# EAGLE design 1u_panel_breakout (EAGLE 9.3.2)
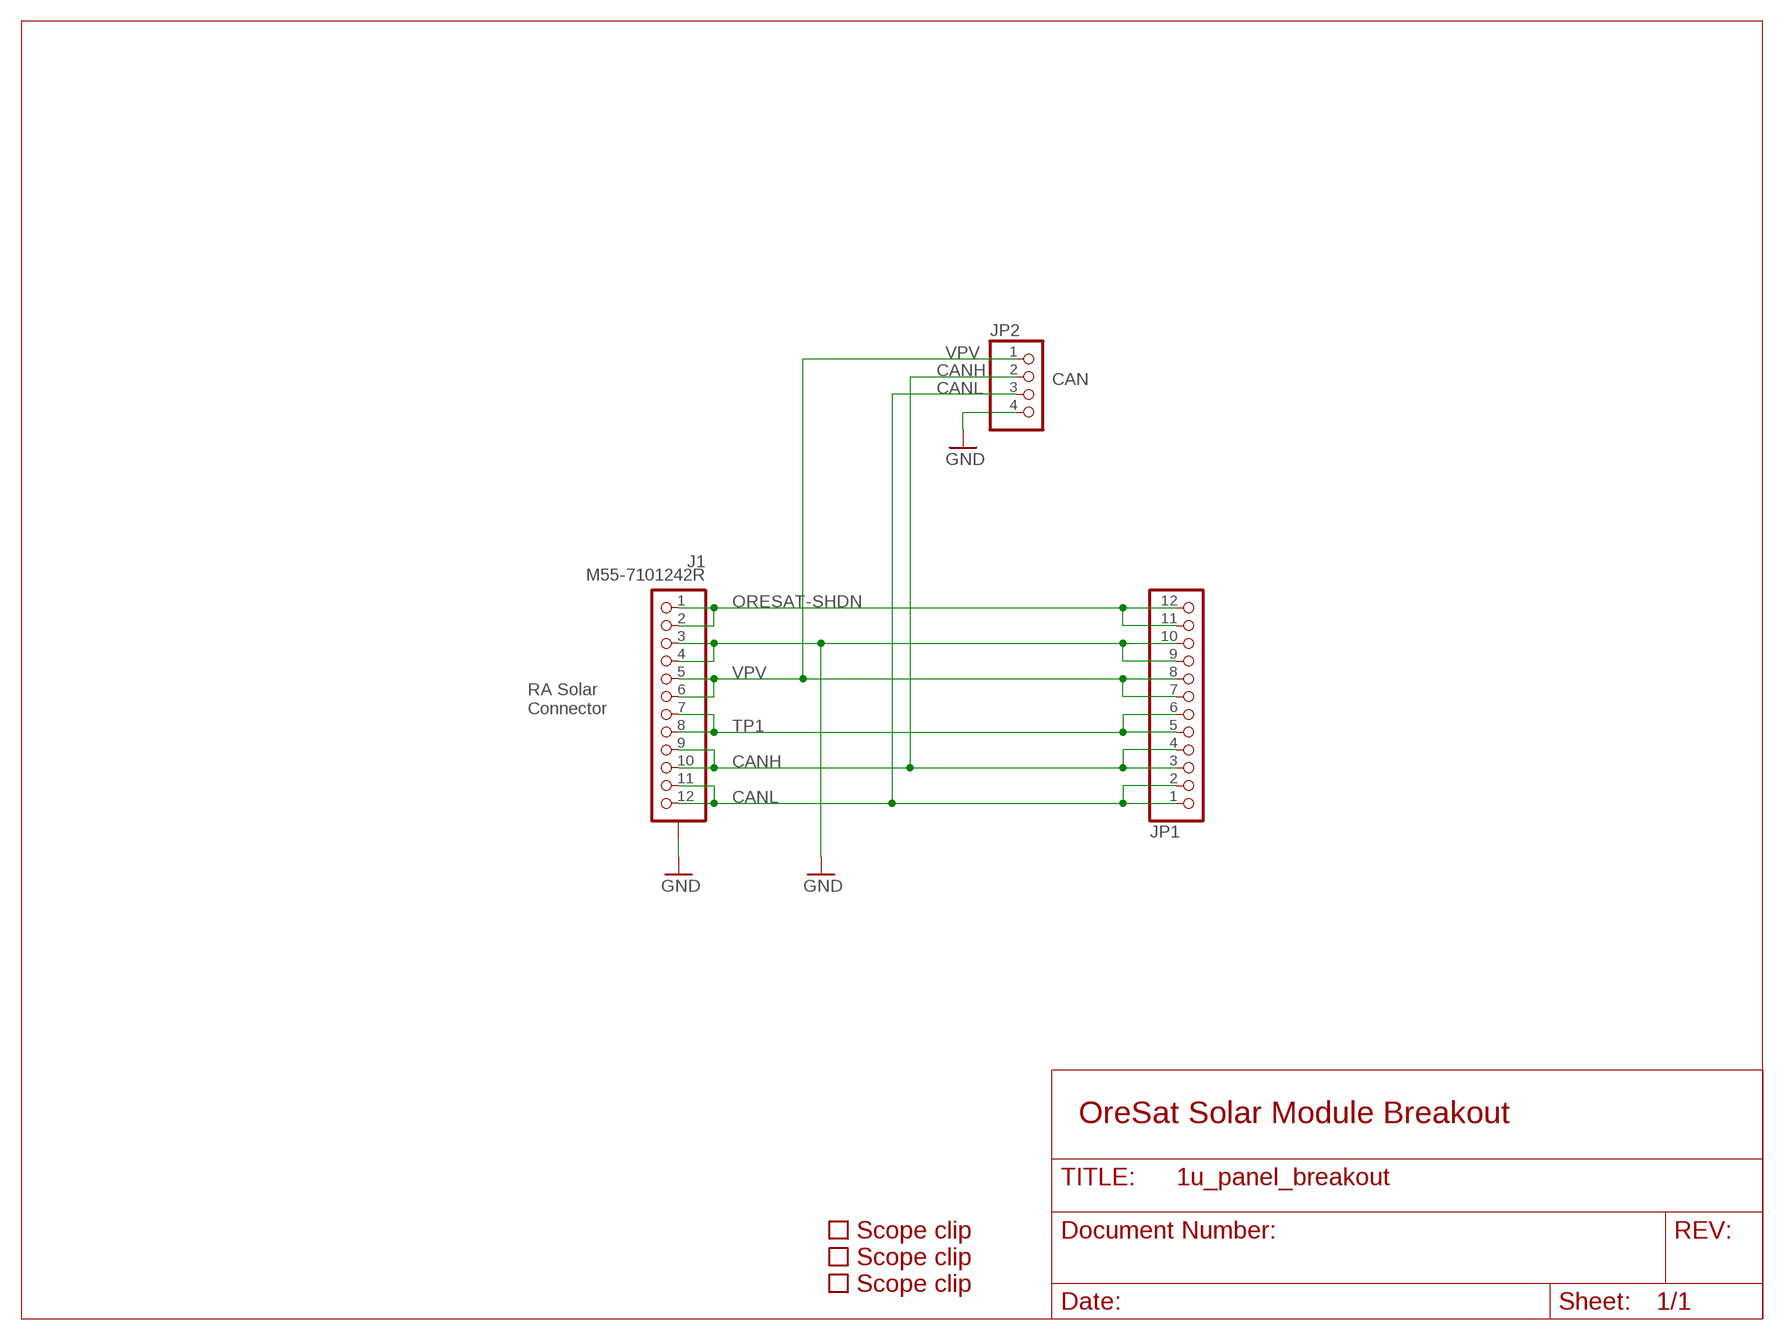
[diagram p0: schematic, sheet 1]

## Parts
J1  M55-7101242R  [M55-7101242R]
JP1  PINHD-1X12  [1X12]
JP2  PINHD-1X4  [1X04]
U$1  SCOPE_CLIP  [SCOPE_CLIP]
U$2  SCOPE_CLIP  [SCOPE_CLIP]
U$3  SCOPE_CLIP  [SCOPE_CLIP]

## Nets
CANH: J1.9 J1.10 JP1.3 JP1.4 JP2.2
CANL: J1.11 J1.12 JP1.1 JP1.2 JP2.3
GND: J1.3 J1.4 J1.P$1(SHIELD) J1.P$2(SHIELD) J1.P$3(SHIELD) J1.P$4(SHIELD) JP1.9 JP1.10 JP2.4
ORESAT-SHDN: J1.1 J1.2 JP1.11 JP1.12
TP1: J1.7 J1.8 JP1.5 JP1.6
VPV: J1.5 J1.6 JP1.7 JP1.8 JP2.1

## Notes on the sheet
- CAN
- RA Solar
  Connector
- OreSat Solar Module Breakout

## Library data of the parts
J1 = J-Harwin-M55-7101242-12pin-1.27mm-M-RA:M55-7101242R: Harwin M55-7101242R A 12 pin 1.27 mm male SMT connector with plastic alignment pins. Note: alignment pin hole diameters are 0.05 mm smaller than recommended in order to tighten up connector location; this requires hand placement of this package.
JP1 = pinhead:PINHD-1X12: PIN HEADER
JP2 = pinhead:PINHD-1X4: PIN HEADER
U$1-U$3 = oresat-misc:SCOPE_CLIP: Ground clip pad for scope

## Board
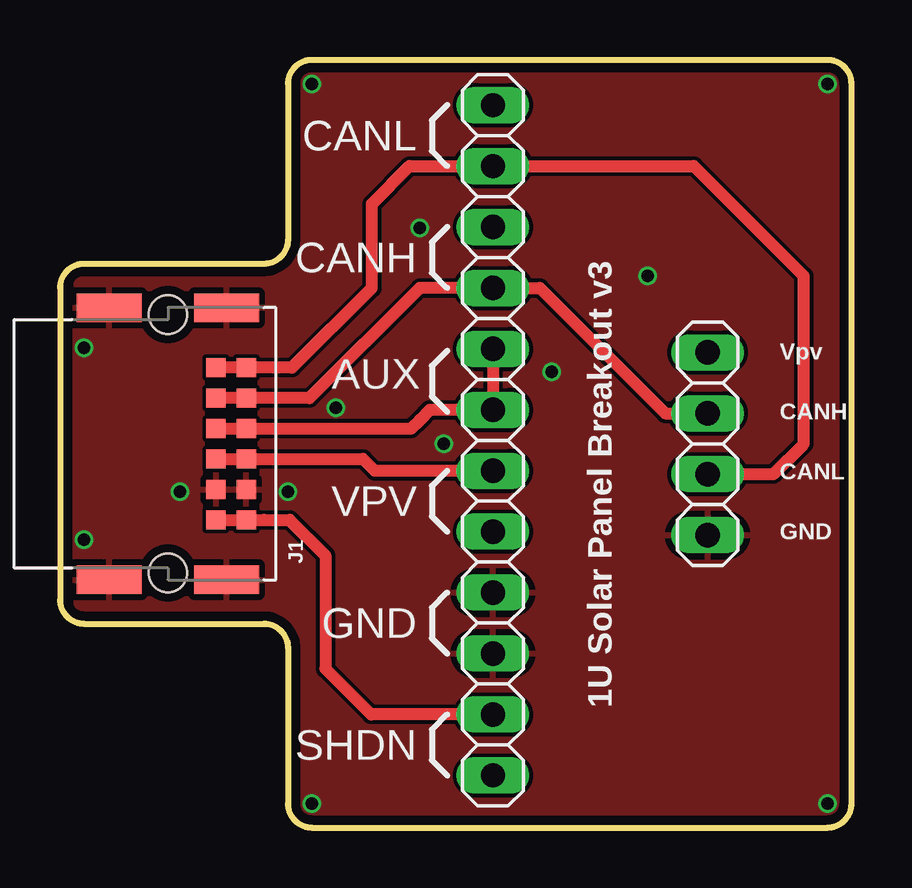
[diagram p1: board, top side]
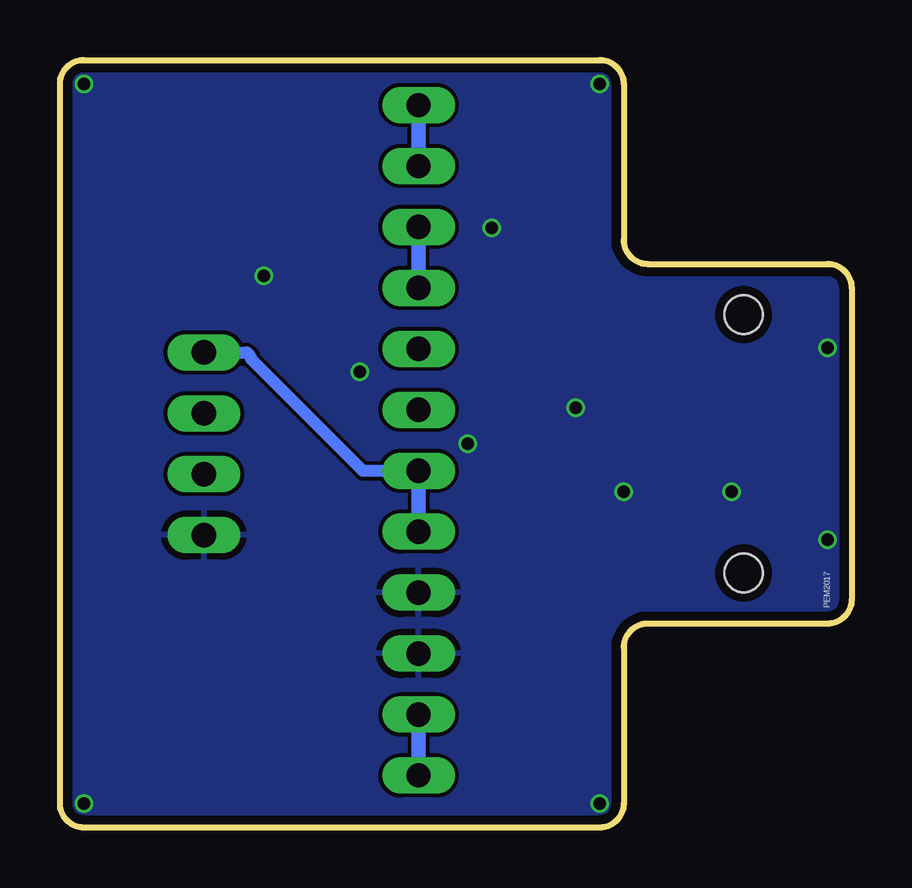
[diagram p2: board, bottom side, seen from below]

Size 33 x 32 mm. Coordinates in mm from the lower left corner, seen from the top.
Outline: 32,32 10.5,32 arc90 9.5,31 9.5,24.5 arc-90 8.5,23.5 1,23.5 arc90 0,22.5 0,9.5 arc90 1,8.5 8.5,8.5 arc-90 9.5,7.5 9.5,1 arc90 10.5,0 32,0 arc90 33,1 33,31 arc90 32,32
Copper layers (1*16): Top 0.035559375mm / dielectric 1.6mm / Bottom 0.035559375mm
Design rules "oshpark-2layer": minimum track width 6mil, minimum drill 10mil, track to track 6mil, track to pad 6mil, pad to pad 6mil, via to via 6mil, smd to smd 6mil, copper to edge 15mil, drill to drill 6mil, minimum pad ring 5mil, minimum via ring 5mil, stop-mask expansion 2.5mil, vias tented up to drill 0mil, thermal gap 10mil

### Footprints (pad centres in the part's own frame; a part is rotated, then mirrored left to right if it is on the bottom)
M55-7101242R = smd 0.8 x 0.8: 1 3.175,2; 2 3.175,3.27; 3 1.905,2; 4 1.905,3.27; 5 0.635,2; 6 0.635,3.27; 7 -0.635,2; 8 -0.635,3.27; 9 -1.905,2; 10 -1.905,3.27; 11 -3.175,2; 12 -3.175,3.27 | smd 1.2 x 2.7: P$1 5.67,2.45; P$2 5.67,-2.45; P$3 -5.67,2.45; P$4 -5.67,-2.45 | hole 1.6: 5.385,0; -5.385,0
1X12 = drill 1.016 long: 1 -13.97,0; 2 -11.43,0; 3 -8.89,0; 4 -6.35,0; 5 -3.81,0; 6 -1.27,0; 7 1.27,0; 8 3.81,0; 9 6.35,0; 10 8.89,0; 11 11.43,0; 12 13.97,0
1X04 = drill 1.016 long: 1 -3.81,0; 2 -1.27,0; 3 1.27,0; 4 3.81,0

### Placement (x,y rotation side)
J1  4.5,16 270 top
JP1  18.05,16.14 270 top
JP2  27,16 270 top
U$1  22.5,2 270 top
U$2  22,30 90 top
U$3  31,9 0 top

### Tracks (layer width: path | path; a pad name or v marks a point on that pad's centre or on a via)
CANH
  Top 0.5: JP2.2 25.23,17.27 20,22.5 JP1.4 15,22.5 10.4,17.91 J1.10 J1.9
  Bottom 0.61: JP1.4 JP1.3
CANL
  Top 0.5: JP2.3 29.73,14.73 31,16 31,23 26.43,27.57 JP1.2 14.57,27.57 13,26 13,22.5 9.68,19.18 J1.12 J1.11
  Bottom 0.61: JP1.2 JP1.1
GND  (via drill 0.51)
  other vias: 15,25 20.5,19 24.5,23 32,31 32,1 1,12 1,20 9.5,14 5,14 11.5,17.5 16,16 10.5,31 10.5,1
  pour Bottom: 0,9.5 0,22.5 arc-90 1,23.5 8.5,23.5 arc90 9.5,24.5 9.5,31 arc-90 10.5,32 32,32 arc-90 33,31 33,1 arc-90 32,0 10.5,0 arc-90 9.5,1 9.5,7.5 arc90 8.5,8.5 0.94,8.5 0.95,8.55 arc-90
  pour Top: 0,9.5 0,22.5 arc-90 1,23.5 8.5,23.5 arc90 9.5,24.5 9.5,31 arc-90 10.5,32 32,32 arc-90 33,31 33,1 arc-90 32,0 10.5,0 arc-90 9.5,1 9.5,7.5 arc90 8.5,8.5 1,8.5 arc-90
ORESAT-SHDN
  Top 0.5: JP1.11 12.97,4.71 11.06,6.62 11.06,11.34 9.57,12.82 8.5,12.82 J1.2 J1.1
  Bottom 0.61: JP1.11 JP1.12
TP1
  Top 0.5: JP1.5 JP1.6 15.41,17.41 15,17 14.63,16.64 J1.8 J1.7
VPV
  Top 0.5: JP1.7 13.12,14.88 12.63,15.37 J1.6 J1.5
  Bottom 0.5: JP2.1 25.22,19.81 arc45 25.02,19.52 20.38,14.88 JP1.7
  Bottom 0.61: JP1.7 JP1.8

### Text on the board
tPlace: CANL | CANH | AUX | Vpv | CANH | VPV | CANL | GND | GND | 1U Solar Panel Breakout v3 | SHDN
bPlace: PEM2017